# EAGLE schematic Amplifier_v1.1 (EAGLE 7.1.0)
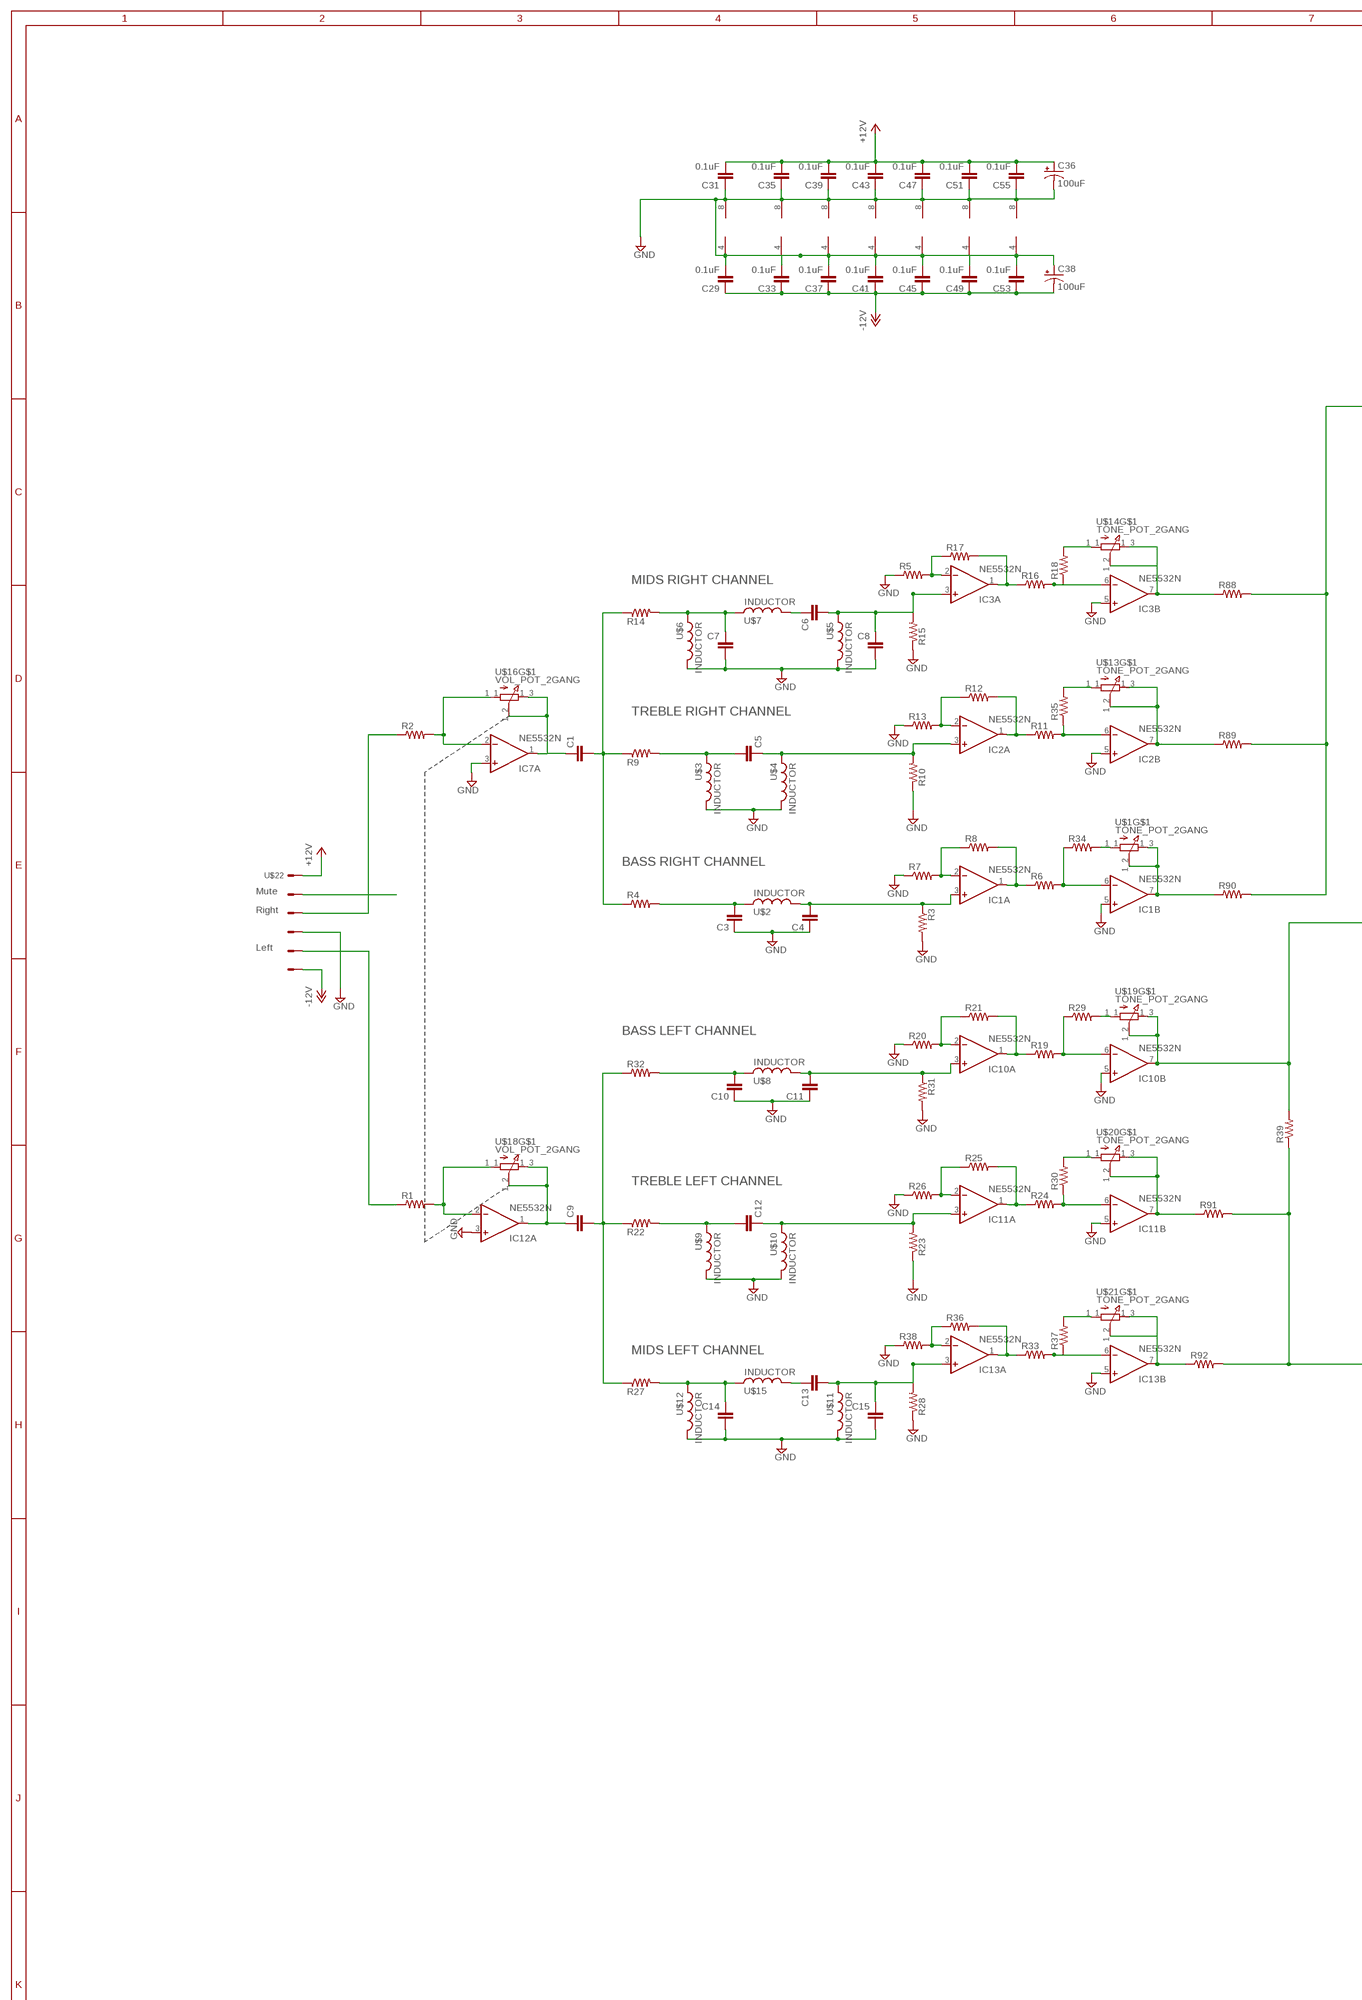
[diagram p0: schematic, sheet 1, part 1 of 3]
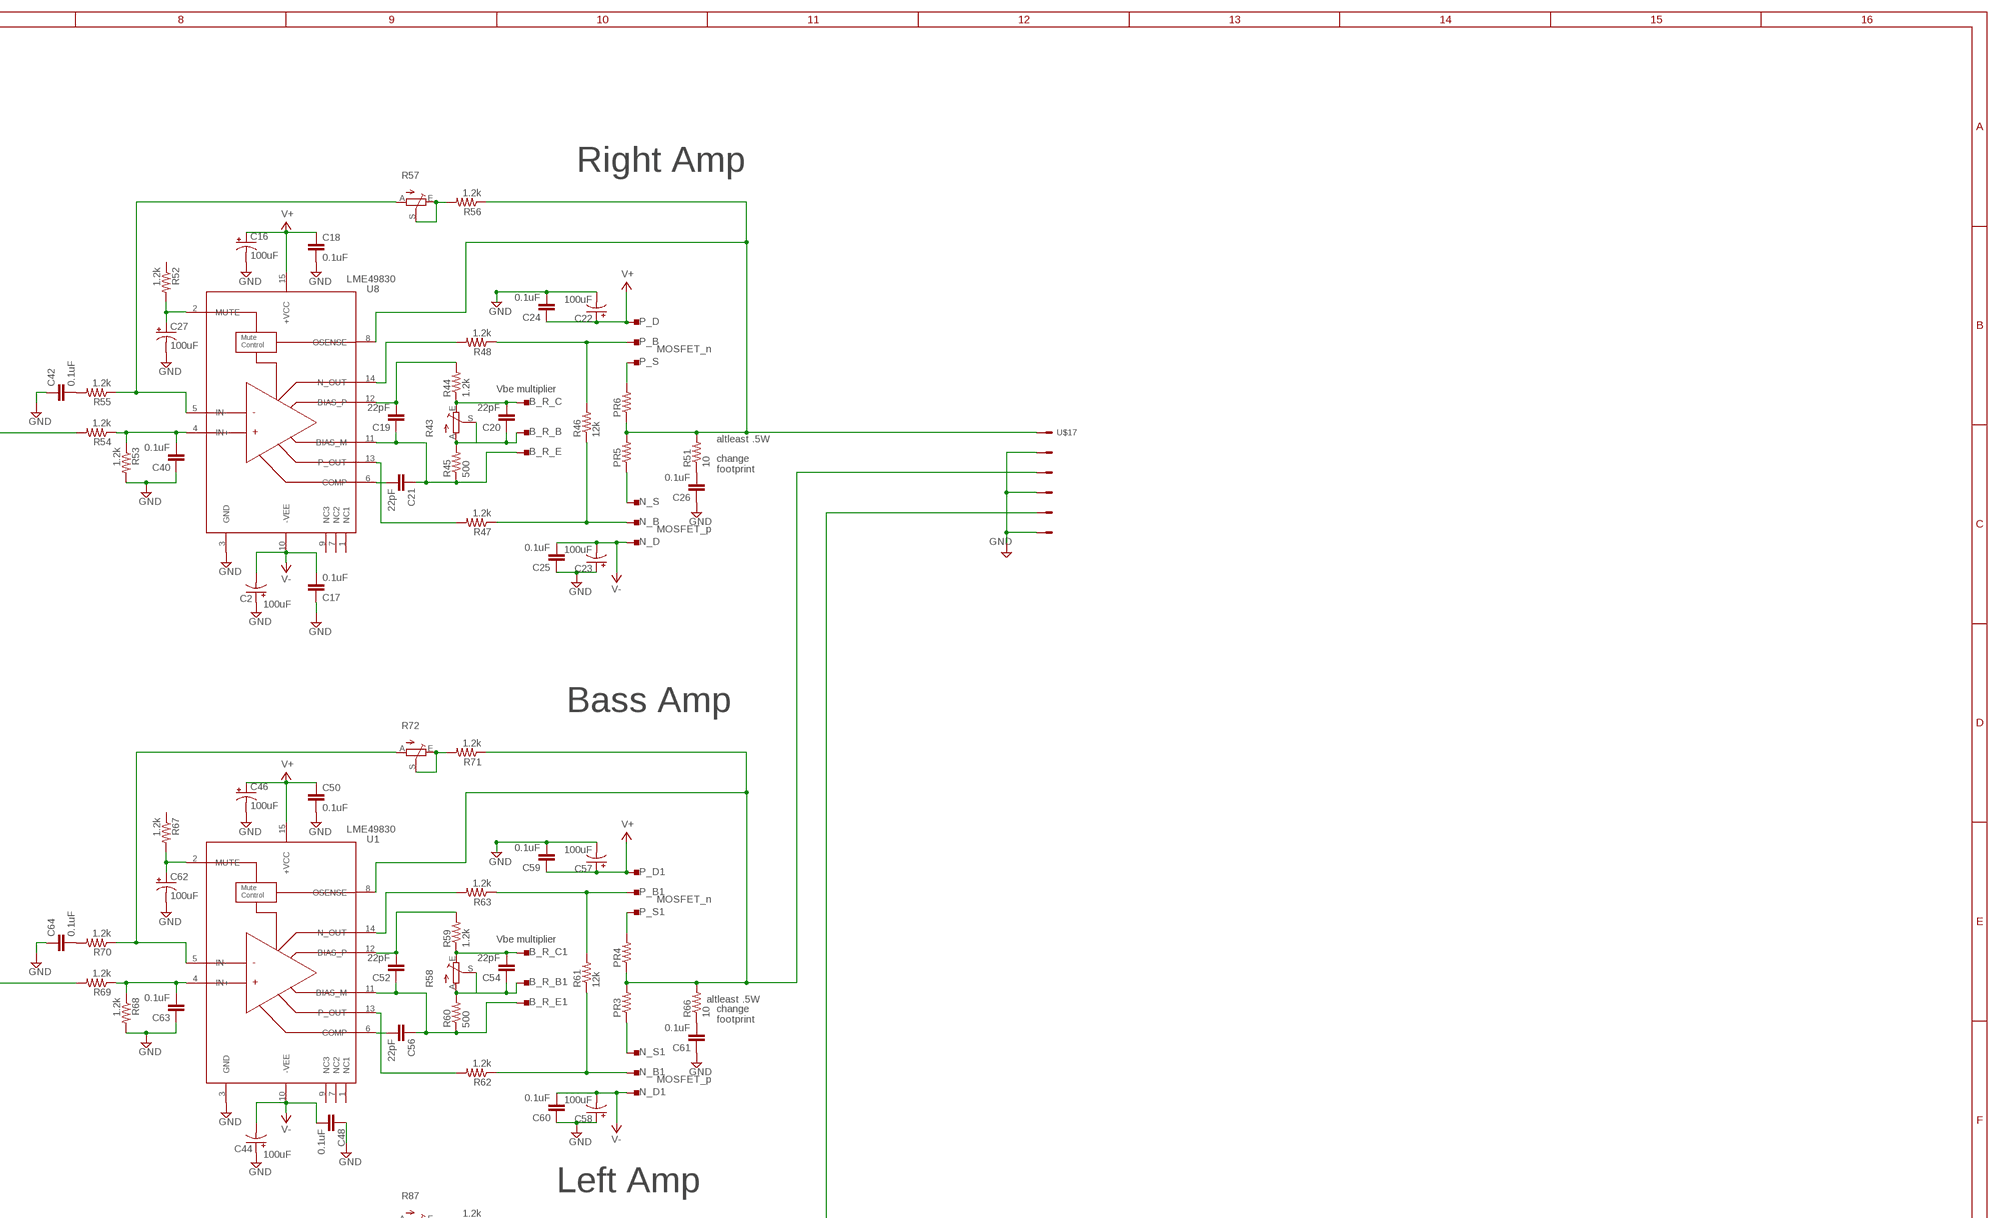
[diagram p1: schematic, sheet 1, part 2 of 3]
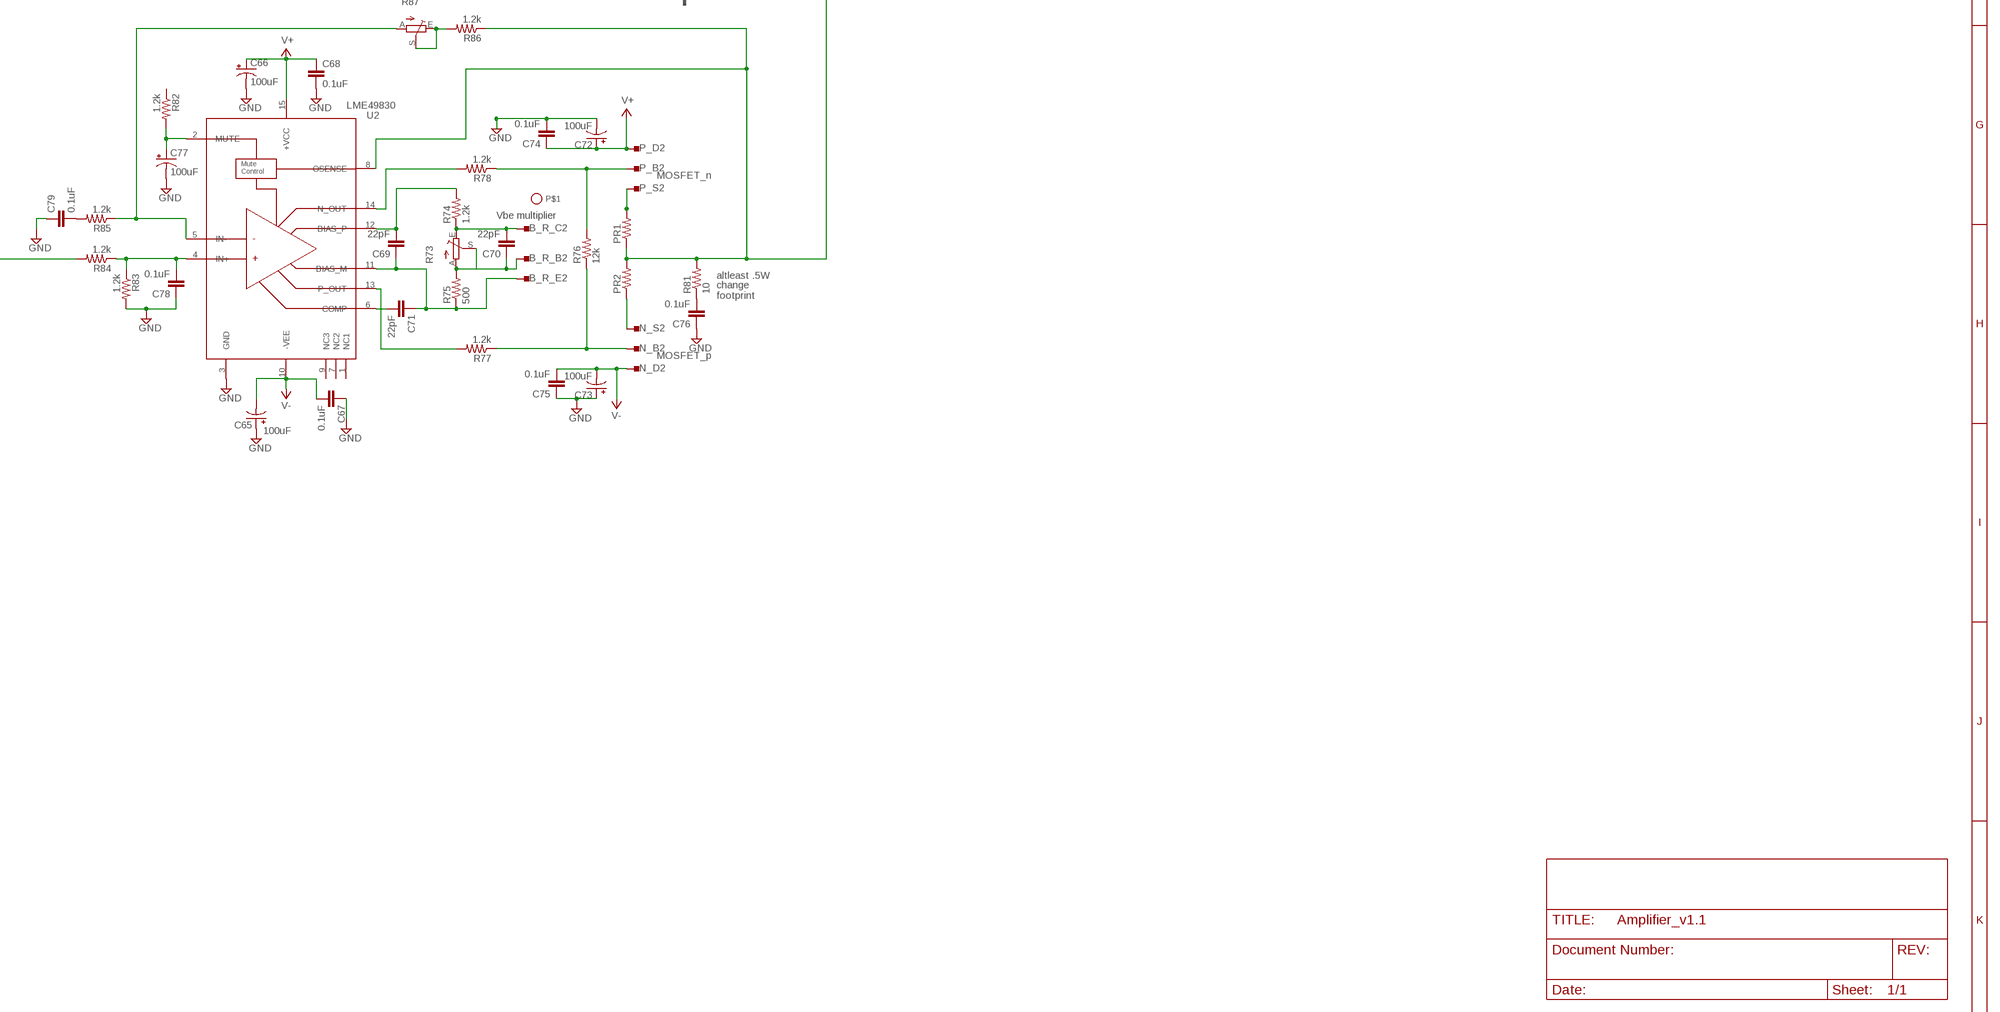
[diagram p2: schematic, sheet 1, part 3 of 3]

## Parts
B_R_B  SMT_PAD_3MM  [SMT_PAD_3MM]
B_R_B1  SMT_PAD_3MM  [SMT_PAD_3MM]
B_R_B2  SMT_PAD_3MM  [SMT_PAD_3MM]
B_R_C  SMT_PAD_3MM  [SMT_PAD_3MM]
B_R_C1  SMT_PAD_3MM  [SMT_PAD_3MM]
B_R_C2  SMT_PAD_3MM  [SMT_PAD_3MM]
B_R_E  SMT_PAD_3MM  [SMT_PAD_3MM]
B_R_E1  SMT_PAD_3MM  [SMT_PAD_3MM]
B_R_E2  SMT_PAD_3MM  [SMT_PAD_3MM]
C1  C-EU025-024X044  [C025-024X044]
C2  100uF  CPOL-USE2.5-6  [E2,5-6]
C3  C-EU025-024X044  [C025-024X044]
C4  C-EU025-024X044  [C025-024X044]
C5  C-EU025-024X044  [C025-024X044]
C6  C-EU025-024X044  [C025-024X044]
C7  C-EU025-024X044  [C025-024X044]
C8  C-EU025-024X044  [C025-024X044]
C9  C-EU025-024X044  [C025-024X044]
C10  C-EU025-024X044  [C025-024X044]
C11  C-EU025-024X044  [C025-024X044]
C12  C-EU025-024X044  [C025-024X044]
C13  C-EU025-024X044  [C025-024X044]
C14  C-EU025-024X044  [C025-024X044]
C15  C-EU025-024X044  [C025-024X044]
C16  100uF  CPOL-USE2.5-6  [E2,5-6]
C17  0.1uF  C-EU025-024X044  [C025-024X044]
C18  0.1uF  C-EU025-024X044  [C025-024X044]
C19  22pF  C-EU025-024X044  [C025-024X044]
C20  22pF  C-EU025-024X044  [C025-024X044]
C21  22pF  C-EU025-024X044  [C025-024X044]
C22  100uF  CPOL-USE2.5-6  [E2,5-6]
C23  100uF  CPOL-USE2.5-6  [E2,5-6]
C24  0.1uF  C-EU025-024X044  [C025-024X044]
C25  0.1uF  C-EU025-024X044  [C025-024X044]
C26  0.1uF  C-EU025-024X044  [C025-024X044]
C27  100uF  CPOL-USE2.5-6  [E2,5-6]
C29  0.1uF  C-EU025-024X044  [C025-024X044]
C31  0.1uF  C-EU025-024X044  [C025-024X044]
C33  0.1uF  C-EU025-024X044  [C025-024X044]
C35  0.1uF  C-EU025-024X044  [C025-024X044]
C36  100uF  CPOL-USE2.5-6  [E2,5-6]
C37  0.1uF  C-EU025-024X044  [C025-024X044]
C38  100uF  CPOL-USE2.5-6  [E2,5-6]
C39  0.1uF  C-EU025-024X044  [C025-024X044]
C40  0.1uF  C-EU025-024X044  [C025-024X044]
C41  0.1uF  C-EU025-024X044  [C025-024X044]
C42  0.1uF  C-EU025-024X044  [C025-024X044]
C43  0.1uF  C-EU025-024X044  [C025-024X044]
C44  100uF  CPOL-USE2.5-6  [E2,5-6]
C45  0.1uF  C-EU025-024X044  [C025-024X044]
C46  100uF  CPOL-USE2.5-6  [E2,5-6]
C47  0.1uF  C-EU025-024X044  [C025-024X044]
C48  0.1uF  C-EU025-024X044  [C025-024X044]
C49  0.1uF  C-EU025-024X044  [C025-024X044]
C50  0.1uF  C-EU025-024X044  [C025-024X044]
C51  0.1uF  C-EU025-024X044  [C025-024X044]
C52  22pF  C-EU025-024X044  [C025-024X044]
C53  0.1uF  C-EU025-024X044  [C025-024X044]
C54  22pF  C-EU025-024X044  [C025-024X044]
C55  0.1uF  C-EU025-024X044  [C025-024X044]
C56  22pF  C-EU025-024X044  [C025-024X044]
C57  100uF  CPOL-USE2.5-6  [E2,5-6]
C58  100uF  CPOL-USE2.5-6  [E2,5-6]
C59  0.1uF  C-EU025-024X044  [C025-024X044]
C60  0.1uF  C-EU025-024X044  [C025-024X044]
C61  0.1uF  C-EU025-024X044  [C025-024X044]
C62  100uF  CPOL-USE2.5-6  [E2,5-6]
C63  0.1uF  C-EU025-024X044  [C025-024X044]
C64  0.1uF  C-EU025-024X044  [C025-024X044]
C65  100uF  CPOL-USE2.5-6  [E2,5-6]
C66  100uF  CPOL-USE2.5-6  [E2,5-6]
C67  0.1uF  C-EU025-024X044  [C025-024X044]
C68  0.1uF  C-EU025-024X044  [C025-024X044]
C69  22pF  C-EU025-024X044  [C025-024X044]
C70  22pF  C-EU025-024X044  [C025-024X044]
C71  22pF  C-EU025-024X044  [C025-024X044]
C72  100uF  CPOL-USE2.5-6  [E2,5-6]
C73  100uF  CPOL-USE2.5-6  [E2,5-6]
C74  0.1uF  C-EU025-024X044  [C025-024X044]
C75  0.1uF  C-EU025-024X044  [C025-024X044]
C76  0.1uF  C-EU025-024X044  [C025-024X044]
C77  100uF  CPOL-USE2.5-6  [E2,5-6]
C78  0.1uF  C-EU025-024X044  [C025-024X044]
C79  0.1uF  C-EU025-024X044  [C025-024X044]
IC1  NE5532N  [DIL08]
IC2  NE5532N  [DIL08]
IC3  NE5532N  [DIL08]
IC4  NE5532N  [DIL08]
IC5  NE5532N  [DIL08]
IC6  NE5532N  [DIL08]
IC7  NE5532N  [DIL08]
IC10  NE5532N  [DIL08]
IC11  NE5532N  [DIL08]
IC12  NE5532N  [DIL08]
IC13  NE5532N  [DIL08]
N_B  SMT_PAD_5MM  [SMT_PAD_5MM]
N_B1  SMT_PAD_5MM  [SMT_PAD_5MM]
N_B2  SMT_PAD_5MM  [SMT_PAD_5MM]
N_D  SMT_PAD_5MM  [SMT_PAD_5MM]
N_D1  SMT_PAD_5MM  [SMT_PAD_5MM]
N_D2  SMT_PAD_5MM  [SMT_PAD_5MM]
N_S  SMT_PAD_5MM  [SMT_PAD_5MM]
N_S1  SMT_PAD_5MM  [SMT_PAD_5MM]
N_S2  SMT_PAD_5MM  [SMT_PAD_5MM]
P1  18AWG  [12AWG_HOLE]
P_B  SMT_PAD_5MM  [SMT_PAD_5MM]
P_B1  SMT_PAD_5MM  [SMT_PAD_5MM]
P_B2  SMT_PAD_5MM  [SMT_PAD_5MM]
P_D  SMT_PAD_5MM  [SMT_PAD_5MM]
P_D1  SMT_PAD_5MM  [SMT_PAD_5MM]
P_D2  SMT_PAD_5MM  [SMT_PAD_5MM]
P_S  SMT_PAD_5MM  [SMT_PAD_5MM]
P_S1  SMT_PAD_5MM  [SMT_PAD_5MM]
P_S2  SMT_PAD_5MM  [SMT_PAD_5MM]
PR1  SQM  [2-1623788-1]
PR2  SQM  [2-1623788-1]
PR3  SQM  [2-1623788-1]
PR4  SQM  [2-1623788-1]
PR5  SQM  [2-1623788-1]
PR6  SQM  [2-1623788-1]
R1  R-US_0204/2V  [0204V]
R2  R-US_0204/2V  [0204V]
R3  R-US_0204/2V  [0204V]
R4  R-US_0204/2V  [0204V]
R5  R-US_0204/2V  [0204V]
R6  R-US_0204/2V  [0204V]
R7  R-US_0204/2V  [0204V]
R8  R-US_0204/2V  [0204V]
R9  R-US_0204/2V  [0204V]
R10  R-US_0204/2V  [0204V]
R11  R-US_0204/2V  [0204V]
R12  R-US_0204/2V  [0204V]
R13  R-US_0204/2V  [0204V]
R14  R-US_0204/2V  [0204V]
R15  R-US_0204/2V  [0204V]
R16  R-US_0204/2V  [0204V]
R17  R-US_0204/2V  [0204V]
R18  R-US_0204/2V  [0204V]
R19  R-US_0204/2V  [0204V]
R20  R-US_0204/2V  [0204V]
R21  R-US_0204/2V  [0204V]
R22  R-US_0204/2V  [0204V]
R23  R-US_0204/2V  [0204V]
R24  R-US_0204/2V  [0204V]
R25  R-US_0204/2V  [0204V]
R26  R-US_0204/2V  [0204V]
R27  R-US_0204/2V  [0204V]
R28  R-US_0204/2V  [0204V]
R29  R-US_0204/2V  [0204V]
R30  R-US_0204/2V  [0204V]
R31  R-US_0204/2V  [0204V]
R32  R-US_0204/2V  [0204V]
R33  R-US_0204/2V  [0204V]
R34  R-US_0204/2V  [0204V]
R35  R-US_0204/2V  [0204V]
R36  R-US_0204/2V  [0204V]
R37  R-US_0204/2V  [0204V]
R38  R-US_0204/2V  [0204V]
R39  R-US_0204/2V  [0204V]
R43  TRIM_EU-B25U  [B25U]
R44  1.2k  R-US_0204/2V  [0204V]
R45  500  R-US_0204/2V  [0204V]
R46  12k  R-US_0204/2V  [0204V]
R47  1.2k  R-US_0204/2V  [0204V]
R48  1.2k  R-US_0204/2V  [0204V]
R51  10  R-US_0204/2V  [0204V]
R52  1.2k  R-US_0204/2V  [0204V]
R53  1.2k  R-US_0204/2V  [0204V]
R54  1.2k  R-US_0204/2V  [0204V]
R55  1.2k  R-US_0204/2V  [0204V]
R56  1.2k  R-US_0204/2V  [0204V]
R57  TRIM_EU-B25U  [B25U]
R58  TRIM_EU-B25U  [B25U]
R59  1.2k  R-US_0204/2V  [0204V]
R60  500  R-US_0204/2V  [0204V]
R61  12k  R-US_0204/2V  [0204V]
R62  1.2k  R-US_0204/2V  [0204V]
R63  1.2k  R-US_0204/2V  [0204V]
R66  10  R-US_0204/2V  [0204V]
R67  1.2k  R-US_0204/2V  [0204V]
R68  1.2k  R-US_0204/2V  [0204V]
R69  1.2k  R-US_0204/2V  [0204V]
R70  1.2k  R-US_0204/2V  [0204V]
R71  1.2k  R-US_0204/2V  [0204V]
R72  TRIM_EU-B25U  [B25U]
R73  TRIM_EU-B25U  [B25U]
R74  1.2k  R-US_0204/2V  [0204V]
R75  500  R-US_0204/2V  [0204V]
R76  12k  R-US_0204/2V  [0204V]
R77  1.2k  R-US_0204/2V  [0204V]
R78  1.2k  R-US_0204/2V  [0204V]
R81  10  R-US_0204/2V  [0204V]
R82  1.2k  R-US_0204/2V  [0204V]
R83  1.2k  R-US_0204/2V  [0204V]
R84  1.2k  R-US_0204/2V  [0204V]
R85  1.2k  R-US_0204/2V  [0204V]
R86  1.2k  R-US_0204/2V  [0204V]
R87  TRIM_EU-B25U  [B25U]
R88  R-US_0204/2V  [0204V]
R89  R-US_0204/2V  [0204V]
R90  R-US_0204/2V  [0204V]
R91  R-US_0204/2V  [0204V]
R92  R-US_0204/2V  [0204V]
U1  LME49830  [NDN0015A]
U2  LME49830  [NDN0015A]
U8  LME49830  [NDN0015A]
U$1  TONE_POT_2GANG  [TONE_POT_2GANG]
U$2  INDUCTOR  [INDUCTOR]
U$3  INDUCTOR  [INDUCTOR]
U$4  INDUCTOR  [INDUCTOR]
U$5  INDUCTOR  [INDUCTOR]
U$6  INDUCTOR  [INDUCTOR]
U$7  INDUCTOR  [INDUCTOR]
U$8  INDUCTOR  [INDUCTOR]
U$9  INDUCTOR  [INDUCTOR]
U$10  INDUCTOR  [INDUCTOR]
U$11  INDUCTOR  [INDUCTOR]
U$12  INDUCTOR  [INDUCTOR]
U$13  TONE_POT_2GANG  [TONE_POT_2GANG]
U$14  TONE_POT_2GANG  [TONE_POT_2GANG]
U$15  INDUCTOR  [INDUCTOR]
U$16  VOL_POT_2GANG  [VOL_POT_2GANG]
U$17  MOLEX_6P  [MOLEX_6P]
U$18  VOL_POT_2GANG  [VOL_POT_2GANG]
U$19  TONE_POT_2GANG  [TONE_POT_2GANG]
U$20  TONE_POT_2GANG  [TONE_POT_2GANG]
U$21  TONE_POT_2GANG  [TONE_POT_2GANG]
U$22  MOLEX_6P  [MOLEX_6P]

## Nets
+12V: C31.2 C35.2 C36.+ C39.2 C43.2 C47.2 C51.2 C55.2 U$22.P$1(S)
-12V: C29.1 C33.1 C37.1 C38.- C41.1 C45.1 C49.1 C53.1 U$22.P$6(S5)
GND: C2.+ C3.1 C4.1 C7.2 C8.2 C10.1 C11.1 C14.2 C15.2 C16.- C17.1 C18.2 C22.- C23.+ C24.2 C25.1 C26.1 C27.- C29.2 C31.1 C33.2 C35.1 C36.- C37.2 C38.+ C39.1 C40.1 C41.2 C42.1 C43.1 C44.+ C45.2 C46.- C47.1 C48.1 C49.2 C50.2 C51.1 C53.2 C55.1 C57.- C58.+ C59.2 C60.1 C61.1 C62.- C63.1 C64.1 C65.+ C66.- C67.1 C68.2 C72.- C73.+ C74.2 C75.1 C76.1 C77.- C78.1 C79.1 IC1.4(P:V-) IC1.5(B:+IN) IC1.8(P:V+) IC2.4(P:V-) IC2.5(B:+IN) IC2.8(P:V+) IC3.4(P:V-) IC3.5(B:+IN) IC3.8(P:V+) IC4.4(P:V-) IC4.8(P:V+) IC5.4(P:V-) IC5.8(P:V+) IC6.4(P:V-) IC6.8(P:V+) IC7.3(A:+IN) IC7.4(P:V-) IC7.8(P:V+) IC10.5(B:+IN) IC11.5(B:+IN) IC12.3(A:+IN) IC13.5(B:+IN) R3.2 R5.1 R7.1 R10.1 R13.1 R15.1 R20.1 R23.1 R26.1 R28.1 R31.2 R38.1 R53.2 R68.2 R83.2 U1.3(GND) U2.3(GND) U8.3(GND) U$3.1 U$4.1 U$5.1 U$6.1 U$9.1 U$10.1 U$11.1 U$12.1 U$17.P$2(S1) U$17.P$4(S3) U$17.P$6(S5) U$22.P$4(S3)
N$1: IC7.2(A:-IN) R2.2 U$16.1_1
N$2: C1.1 IC7.1(A:OUT) U$16.1_2 U$16.1_3
N$3: IC12.2(A:-IN) R1.2 U$18.1_1
N$4: R48.2 U8.14(N_OUT)
N$5: C9.1 IC12.1(A:OUT) U$18.1_2 U$18.1_3
N$6: IC1.2(A:-IN) R7.2 R8.1
N$7: C4.2 IC1.3(A:+IN) R3.1 U$2.1
N$8: B_R_C1.PAD C54.2 R58.E R59.1
N$9: IC2.2(A:-IN) R12.1 R13.2
N$10: R54.2 R88.2 R89.2 R90.2
N$11: IC1.6(B:-IN) R6.2 R34.1
N$12: C3.2 R4.2 U$2.2
N$13: C5.2 R9.2 U$3.2
N$14: C11.2 IC10.3(A:+IN) R31.1 U$8.1
N$15: IC3.1(A:OUT) R16.1 R17.2
N$16: C40.2 R53.1 R54.1 U8.4(IN+)
N$17: IC2.1(A:OUT) R11.1 R12.2
N$18: IC2.6(B:-IN) R11.2 R35.1
N$19: IC3.6(B:-IN) R16.2 R18.1
N$20: B_R_B1.PAD C54.1 R58.A R58.S R60.2
N$21: IC3.7(B:OUT) R88.1 U$14.1_2 U$14.1_3
N$22: C1.2 R4.1 R9.1 R14.1
N$23: C7.1 R14.2 U$6.2 U$7.2
N$24: R18.2 U$14.1_1
N$25: IC10.6(B:-IN) R19.2 R29.1
N$26: R2.1 U$22.P$3(S2)
N$27: IC3.2(A:-IN) R5.2 R17.1
N$28: C52.2 R59.2 U1.12(BIAS_P)
N$29: C6.1 U$7.1
N$30: C12.2 R22.2 U$9.2
N$31: R55.1 R57.A U8.5(IN-)
N$32: IC11.1(A:OUT) R24.1 R25.2
N$33: IC11.6(B:-IN) R24.2 R30.1
N$34: C14.1 R27.2 U$12.2 U$15.2
N$35: C13.1 U$15.1
N$36: C42.2 R55.2
N$37: R29.2 U$19.1_1
N$38: R39.1 R84.2 R91.2 R92.2
N$39: B_R_E1.PAD C52.1 C56.1 R60.1 U1.11(BIAS_M)
N$40: R56.2 R57.E R57.S
N$41: IC11.7(B:OUT) R91.1 U$20.1_2 U$20.1_3
N$42: R30.2 U$20.1_1
N$43: IC10.1(A:OUT) R19.1 R21.2
N$44: C10.2 R32.2 U$8.2
N$45: IC10.2(A:-IN) R20.2 R21.1
N$46: IC11.2(A:-IN) R25.1 R26.2
N$47: IC13.1(A:OUT) R33.1 R36.2
N$48: C56.2 U1.6(COMP)
N$49: IC13.6(B:-IN) R33.2 R37.1
N$50: IC13.7(B:OUT) R92.1 U$21.1_2 U$21.1_3
N$51: R62.2 U1.13(P_OUT)
N$52: P_B1.PAD R61.2 R63.1
N$53: R34.2 U$1.1_1
N$54: IC1.7(B:OUT) R90.1 U$1.1_2 U$1.1_3
N$55: IC2.7(B:OUT) R89.1 U$13.1_2 U$13.1_3
N$56: R35.2 U$13.1_1
N$57: R37.2 U$21.1_1
N$58: IC13.2(A:-IN) R36.1 R38.2
N$59: C13.2 C15.1 IC13.3(A:+IN) R28.2 U$11.2
N$60: C9.2 R22.1 R27.1 R32.1
N$61: C12.1 IC11.3(A:+IN) R23.2 U$10.2
N$62: N_B1.PAD R61.1 R62.1
N$63: C5.1 IC2.3(A:+IN) R10.2 U$4.2
N$64: IC10.7(B:OUT) R39.2 R69.2 U$19.1_2 U$19.1_3
N$65: B_R_C.PAD C20.2 R43.E R44.1
N$66: C21.2 U8.6(COMP)
N$67: B_R_E.PAD C19.1 C21.1 R45.1 U8.11(BIAS_M)
N$68: B_R_B.PAD C20.1 R43.A R43.S R45.2
N$69: C19.2 R44.2 U8.12(BIAS_P)
N$70: R47.2 U8.13(P_OUT)
N$71: P_S1.PAD PR4.P$4
N$72: P_B.PAD R46.2 R48.1
N$73: N_B.PAD R46.1 R47.1
N$74: P_S.PAD PR6.P$4
N$75: PR5.P$4 PR6.P$3 R51.2 R56.1 U8.8(OSENSE) U$17.P$1(S)
N$76: PR3.P$4 PR4.P$3 R66.2 R71.1 U1.8(OSENSE) U$17.P$3(S2)
N$77: C61.2 R66.1
N$78: C62.+ R67.2 U1.2(MUTE)
N$79: R63.2 U1.14(N_OUT)
N$80: C63.2 R68.1 R69.1 U1.4(IN+)
N$81: C64.2 R70.2
N$82: R70.1 R72.A U1.5(IN-)
N$83: R71.2 R72.E R72.S
N$84: C26.2 R51.1
N$85: C27.+ R52.2 U8.2(MUTE)
N$86: B_R_C2.PAD C70.2 R73.E R74.1
N$87: B_R_B2.PAD C70.1 R73.A R73.S R75.2
N$88: IC1.1(A:OUT) R6.1 R8.2
N$89: C69.2 R74.2 U2.12(BIAS_P)
N$90: B_R_E2.PAD C69.1 C71.1 R75.1 U2.11(BIAS_M)
N$91: C71.2 U2.6(COMP)
N$92: R77.2 U2.13(P_OUT)
N$93: P_B2.PAD R76.2 R78.1
N$94: N_B2.PAD R76.1 R77.1
N$95: P_S2.PAD PR1.P$4
N$96: PR1.P$3 PR2.P$4 R81.2 R86.1 U2.8(OSENSE) U$17.P$5(S4)
N$97: C76.2 R81.1
N$98: C77.+ R82.2 U2.2(MUTE)
N$99: R78.2 U2.14(N_OUT)
N$100: C78.2 R83.1 R84.1 U2.4(IN+)
N$101: C79.2 R85.2
N$102: R85.1 R87.A U2.5(IN-)
N$103: R86.2 R87.E R87.S
N$104: C6.2 C8.1 IC3.3(A:+IN) R15.2 U$5.2
N$105: U$22.P$2(S1)
N$106: N_S1.PAD PR3.P$3
N$108: R1.1 U$22.P$5(S4)
N$109: N_S2.PAD PR2.P$3
N$110: N_S.PAD PR5.P$3
V+: C16.+ C18.1 C46.+ C50.1 C66.+ C68.1 U1.15(+VCC) U2.15(+VCC) U8.15(+VCC)
V-: C2.- C17.2 C23.- C25.2 C44.- C48.2 C58.- C60.2 C65.- C67.2 C73.- C75.2 N_D1.PAD N_D2.PAD N_D.PAD U1.10(-VEE) U2.10(-VEE) U8.10(-VEE)
VCC: C22.+ C24.1 C57.+ C59.1 C72.+ C74.1 P_D1.PAD P_D2.PAD P_D.PAD ; supply symbol labelled V+
Unconnected: IC4.1(A:OUT) IC4.2(A:-IN) IC4.3(A:+IN) IC4.5(B:+IN) IC4.6(B:-IN) IC4.7(B:OUT) IC5.1(A:OUT) IC5.2(A:-IN) IC5.3(A:+IN) IC5.5(B:+IN) IC5.6(B:-IN) IC5.7(B:OUT) IC6.1(A:OUT) IC6.2(A:-IN) IC6.3(A:+IN) IC6.5(B:+IN) IC6.6(B:-IN) IC6.7(B:OUT) IC7.5(B:+IN) IC7.6(B:-IN) IC7.7(B:OUT) IC12.5(B:+IN) IC12.6(B:-IN) IC12.7(B:OUT) P1.P$1 R52.1 R67.1 R82.1 U1.1(NC1) U1.7(NC2) U1.9(NC3) U2.1(NC1) U2.7(NC2) U2.9(NC3) U8.1(NC1) U8.7(NC2) U8.9(NC3) U$1.2_1(1_1) U$1.2_2(1_2) U$1.2_3(1_3) U$13.2_1(1_1) U$13.2_2(1_2) U$13.2_3(1_3) U$14.2_1(1_1) U$14.2_2(1_2) U$14.2_3(1_3) U$16.2_1(1_1) U$16.2_2(1_2) U$16.2_3(1_3) U$18.2_1(1_1) U$18.2_2(1_2) U$18.2_3(1_3) U$19.2_1(1_1) U$19.2_2(1_2) U$19.2_3(1_3) U$20.2_1(1_1) U$20.2_2(1_2) U$20.2_3(1_3) U$21.2_1(1_1) U$21.2_2(1_2) U$21.2_3(1_3)

## Notes on the sheet
- Right Amp
- MOSFET_n
- Vbe multiplier
- altleast .5W
- change
  footprint
- MOSFET_p
- MIDS RIGHT CHANNEL
- Bass Amp
- TREBLE RIGHT CHANNEL
- MOSFET_n
- BASS RIGHT CHANNEL
- Vbe multiplier
- Mute
- Right
- altleast .5W
- Left
- change
  footprint
- MOSFET_p
- BASS LEFT CHANNEL
- Left Amp
- TREBLE LEFT CHANNEL
- MOSFET_n
- Vbe multiplier
- MIDS LEFT CHANNEL
- altleast .5W
- change
  footprint
- MOSFET_p

## Power pins joined to a net without a drawn wire
V+: IC10.8(P:V+) IC11.8(P:V+) IC12.8(P:V+) IC13.8(P:V+)
V-: IC10.4(P:V-) IC11.4(P:V-) IC12.4(P:V-) IC13.4(P:V-)

## Library data of the parts
B_R_B B_R_B1 B_R_B2 B_R_C B_R_C1 B_R_C2 B_R_E B_R_E1 B_R_E2 = Amplifier_Parts:SMT_PAD_3MM
C1 C3-C15 C17-C21 C24-C26 C29 C31 C33 C35 C37 C39-C43 C45 C47-C56 C59-C61 C63 C64 C67-C71 C74-C76 C78 C79 = rcl:C-EU: CAPACITOR, European symbol
C2 C16 C22 C23 C27 C36 C38 C44 C46 C57 C58 C62 C65 C66 C72 C73 C77 = rcl:CPOL-US: POLARIZED CAPACITOR, American symbol
IC1-IC7 IC10-IC13 = linear:NE5532: AUDIO AMPLIFIER
N_B N_B1 N_B2 N_D N_D1 N_D2 N_S N_S1 N_S2 P_B P_B1 P_B2 P_D P_D1 P_D2 P_S P_S1 P_S2 = Amplifier_Parts:SMT_PAD_5MM
P1 = AWG Holes:18AWG
PR1-PR6 = Power Resistors:SQM; POWER_LEVEL: 5W
R1-R39 R44-R48 R51-R56 R59-R63 R66-R71 R74-R78 R81-R86 R88-R92 = rcl:R-US_: RESISTOR, American symbol
R43 R57 R58 R72 R73 R87 = pot:TRIM_EU-: POTENTIOMETER
U1 U2 U8 = texas:LME49830: Mono High Fidelity 200V MOSFET Power Amplifier +/-20V to +/-200V Power Supply
U$1 U$13 U$14 U$19-U$21 = Amplifier_Parts:TONE_POT_2GANG
U$2-U$12 U$15 = Amplifier_Parts:INDUCTOR
U$16 U$18 = Amplifier_Parts:VOL_POT_2GANG
U$17 U$22 = Amplifier_Parts:MOLEX_6P